# EasyEDA Pro project bipedwheel.eprj

# Schematic Schematic1
Board Name: Board1; Create Date: 2025-10-13; Page Name: P1; Project Name: bipedwheel; Schematic Name: Schematic1; Update Date: 2025-10-13; Company: 嘉立创EDA; Page Size: A4; Version: V1.0
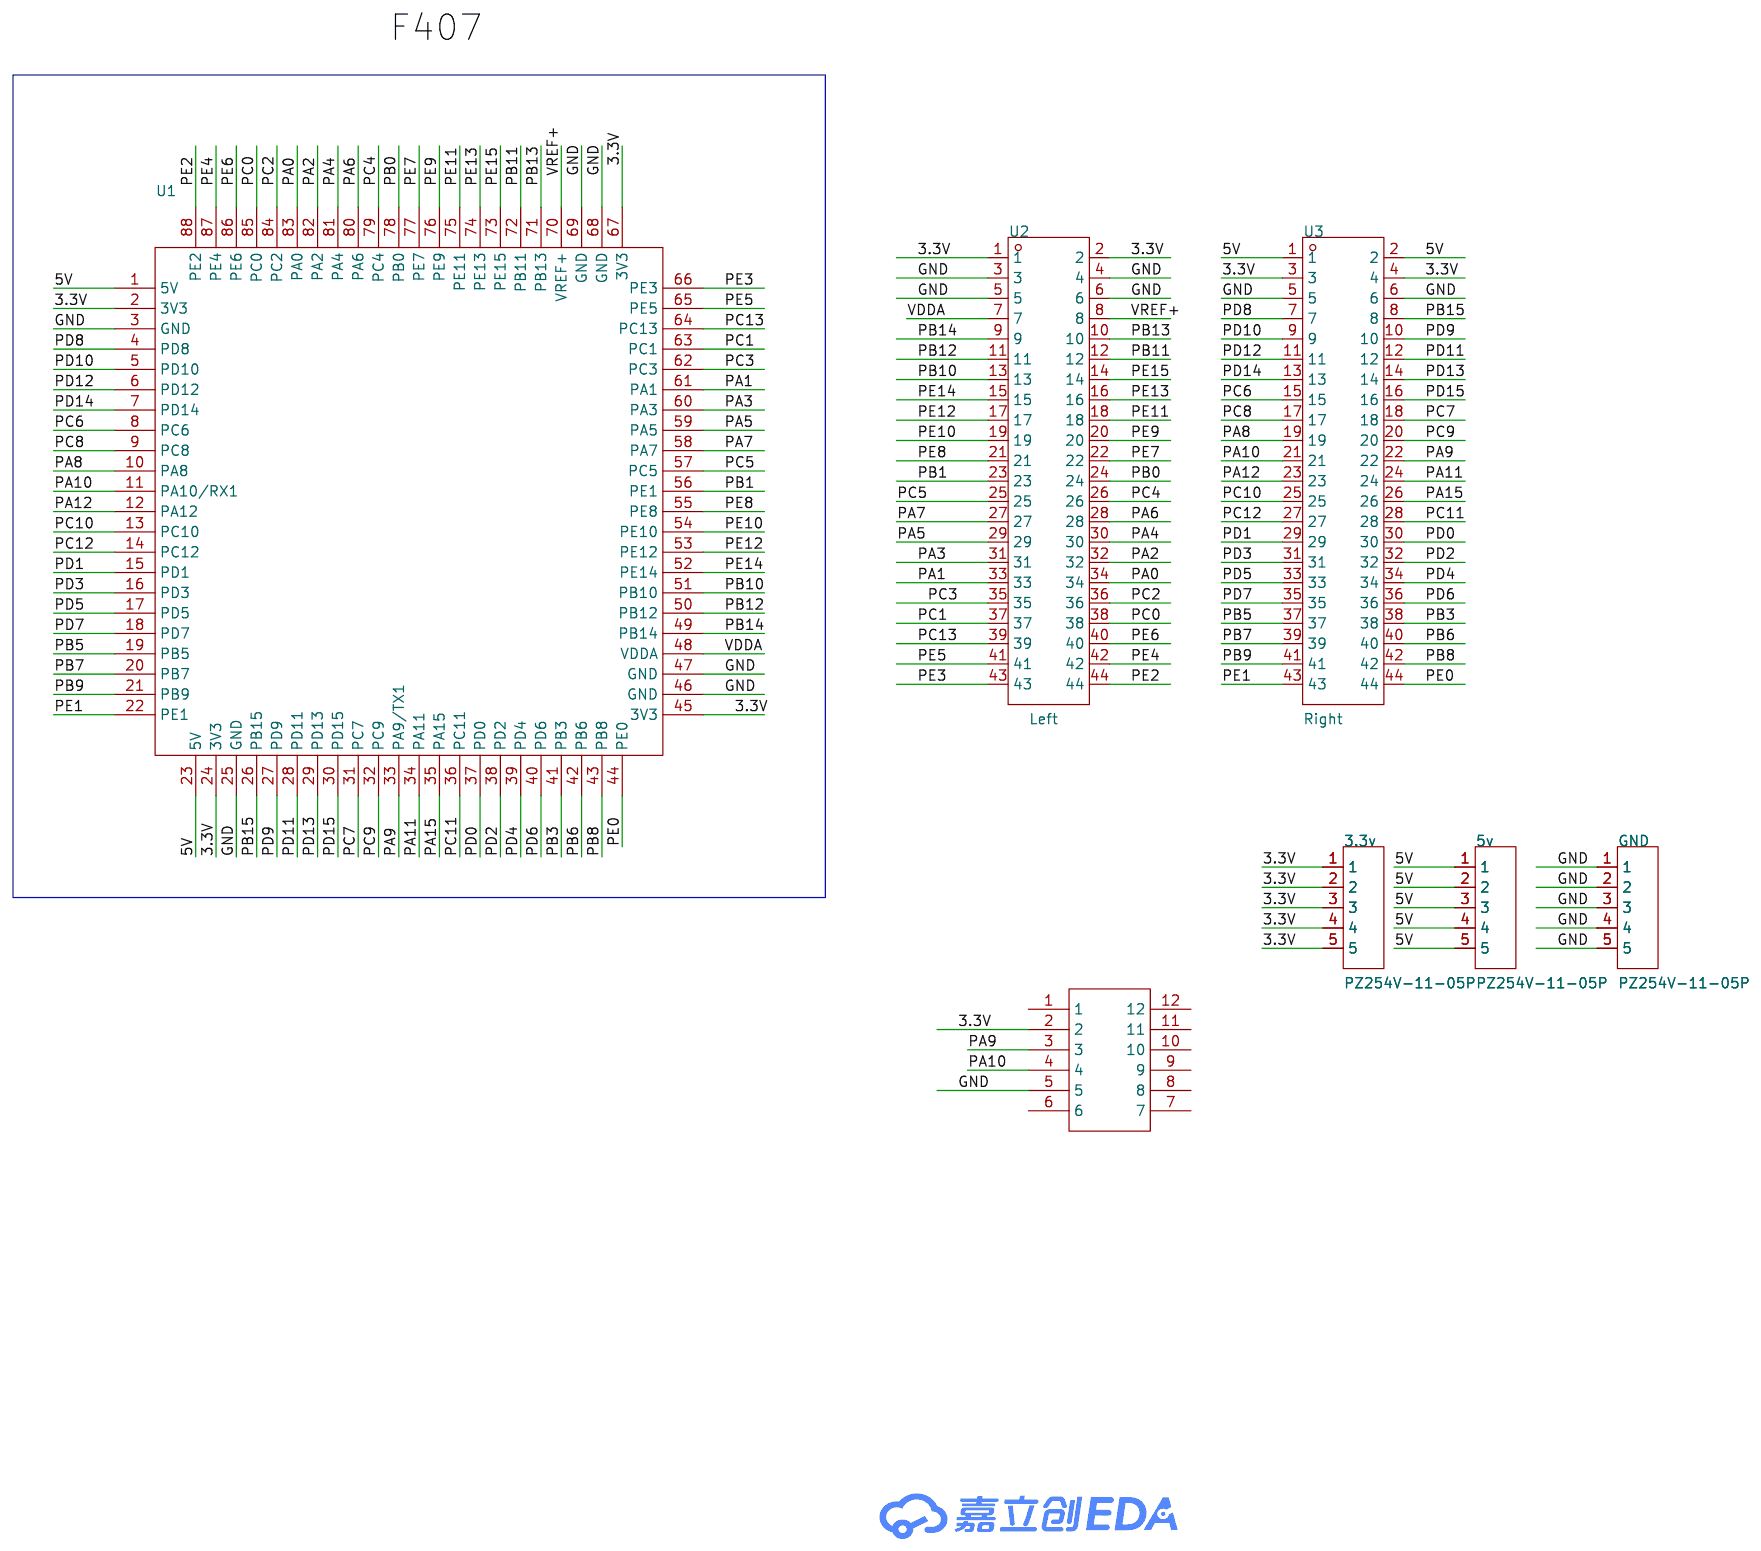
[diagram p0: schematic sheet]

## Parts
3.3v  PZ254V-11-05P  [HDR-TH_5P-P2.54-V-M]
5v  PZ254V-11-05P  [HDR-TH_5P-P2.54-V-M]
GND  PZ254V-11-05P  [HDR-TH_5P-P2.54-V-M]
JY901S  -  [JY901S_插件]
U1  -  [STM32F4XX最小系统板]
U2  Left  [HDR-TH_44P-P2.54-V-F-R2-C22-S2.54]
U3  Right  [HDR-TH_44P-P2.54-V-F-R2-C22-S2.54]

## Library data of the parts
3.3v 5v GND = PZ254V-11-05P: LCSC Part Name: 1x5P 间距:2.54mm 方针 直插; Supplier Part: C492404; Manufacturer: XFCN(兴飞); Supplier Footprint: 插件,P=2.54mm; JLCPCB Part Class: 扩展库; Datasheet: https://atta.szlcsc.com/upload/public/pdf/source/20200309/C492404_E51533260F8710EFF5D4617281164C1D.pdf; Supplier: LCSC; Pin Structure: 1x5P; Pitch: 2.54mm; Circluar Pins/Square Pins: 方针; Mounting Type: 直插; Number of Rows: 单排; Number of Pins: 5P; Length of Mating Pin: 6mm; Insulation Height: 2.5mm; Length of End Connection Pin: 3mm; Contact Material: 黄铜; Operating Temperature: -40℃~+105℃; Color: 黑色
JY901S = JY901S_插件
U1 = STM32F4xx 最小系统板
U2 U3 = X6521FV-2x22-C85D32: LCSC Part Name: 间距:2.54mm 2x22P 直插; Supplier Part: C2883995; Manufacturer: XKB Connection(中国星坤); Supplier Footprint: 插件,P=2.54mm; JLCPCB Part Class: 扩展库; Datasheet: https://item.szlcsc.com/datasheet/X6521FV-2x22-C85D32/3094487.html; Supplier: LCSC; Holes Structure: 2x22P; Pitch: 2.54mm; Row Spacing: 2.54mm; Circular Hole / Square Hole: 方孔; Mounting Type: 直插; Number of Rows: 双排; Number of Positions: 44P; Current Rating: 3A; Voltage Rating (Max): 250V; Holes Direction: 顶部; Insulation Height: 8.5mm; Contact Material: 黄铜; Contact Plating: 金; Operating Temperature: -40℃~+105℃

## Nets
3.3V: 3.3v.1 3.3v.2 3.3v.3 3.3v.4 3.3v.5 JY901S.2 U1.2(3V3) U1.24(3V3) U1.45(3V3) U1.67(3V3) U2.1 U2.2 U3.3 U3.4
5V: 5v.1 5v.2 5v.3 5v.4 5v.5 U1.1(5V) U1.23(5V) U3.1 U3.2
GND: GND.1 GND.2 GND.3 GND.4 GND.5 JY901S.5 U1.3(GND) U1.25(GND) U1.46(GND) U1.47(GND) U1.68(GND) U1.69(GND) U2.3 U2.4 U2.5 U2.6 U3.5 U3.6
VDDA: U1.48(VDDA) U2.7
PA0: U1.83(PA0) U2.34
PA1: U1.61(PA1) U2.33
PA2: U1.82(PA2) U2.32
PA3: U1.60(PA3) U2.31
PA4: U1.81(PA4) U2.30
PA5: U1.59(PA5) U2.29
PA6: U1.80(PA6) U2.28
PA7: U1.58(PA7) U2.27
PA8: U1.10(PA8) U3.19
PA9: JY901S.3 U1.33(PA9/TX1) U3.22
PA10: JY901S.4 U1.11(PA10/RX1) U3.21
PA11: U1.34(PA11) U3.24
PA12: U1.12(PA12) U3.23
PA15: U1.35(PA15) U3.26
PB0: U1.78(PB0) U2.24
PB1: U1.56(PE1) U2.23
PB3: U1.41(PB3) U3.38
PB5: U1.19(PB5) U3.37
PB6: U1.42(PB6) U3.40
PB7: U1.20(PB7) U3.39
PB8: U1.43(PB8) U3.42
PB9: U1.21(PB9) U3.41
PB10: U1.51(PB10) U2.13
PB11: U1.72(PB11) U2.12
PB12: U1.50(PB12) U2.11
PB13: U1.71(PB13) U2.10
PB14: U1.49(PB14) U2.9
PB15: U1.26(PB15) U3.8
PC0: U1.85(PC0) U2.38
PC1: U1.63(PC1) U2.37
PC2: U1.84(PC2) U2.36
PC3: U1.62(PC3) U2.35
PC4: U1.79(PC4) U2.26
PC5: U1.57(PC5) U2.25
PC6: U1.8(PC6) U3.15
PC7: U1.31(PC7) U3.18
PC8: U1.9(PC8) U3.17
PC9: U1.32(PC9) U3.20
PC10: U1.13(PC10) U3.25
PC11: U1.36(PC11) U3.28
PC12: U1.14(PC12) U3.27
PC13: U1.64(PC13) U2.39
PD0: U1.37(PD0) U3.30
PD1: U1.15(PD1) U3.29
PD2: U1.38(PD2) U3.32
PD3: U1.16(PD3) U3.31
PD4: U1.39(PD4) U3.34
PD5: U1.17(PD5) U3.33
PD6: U1.40(PD6) U3.36
PD7: U1.18(PD7) U3.35
PD8: U1.4(PD8) U3.7
PD9: U1.27(PD9) U3.10
PD10: U1.5(PD10) U3.9
PD11: U1.28(PD11) U3.12
PD12: U1.6(PD12) U3.11
PD13: U1.29(PD13) U3.14
PD14: U1.7(PD14) U3.13
PD15: U1.30(PD15) U3.16
PE0: U1.44(PE0) U3.44
PE1: U1.22(PE1) U3.43
PE2: U1.88(PE2) U2.44
PE3: U1.66(PE3) U2.43
PE4: U1.87(PE4) U2.42
PE5: U1.65(PE5) U2.41
PE6: U1.86(PE6) U2.40
PE7: U1.77(PE7) U2.22
PE8: U1.55(PE8) U2.21
PE9: U1.76(PE9) U2.20
PE10: U1.54(PE10) U2.19
PE11: U1.75(PE11) U2.18
PE12: U1.53(PE12) U2.17
PE13: U1.74(PE13) U2.16
PE14: U1.52(PE14) U2.15
PE15: U1.73(PE15) U2.14
VREF+: U1.70(VREF+) U2.8

Not connected (* = marked no-connect by the designer): JY901S 1 6 7 8 9 10 11 12

## Notes on the sheet
- F407

# Board PCB1
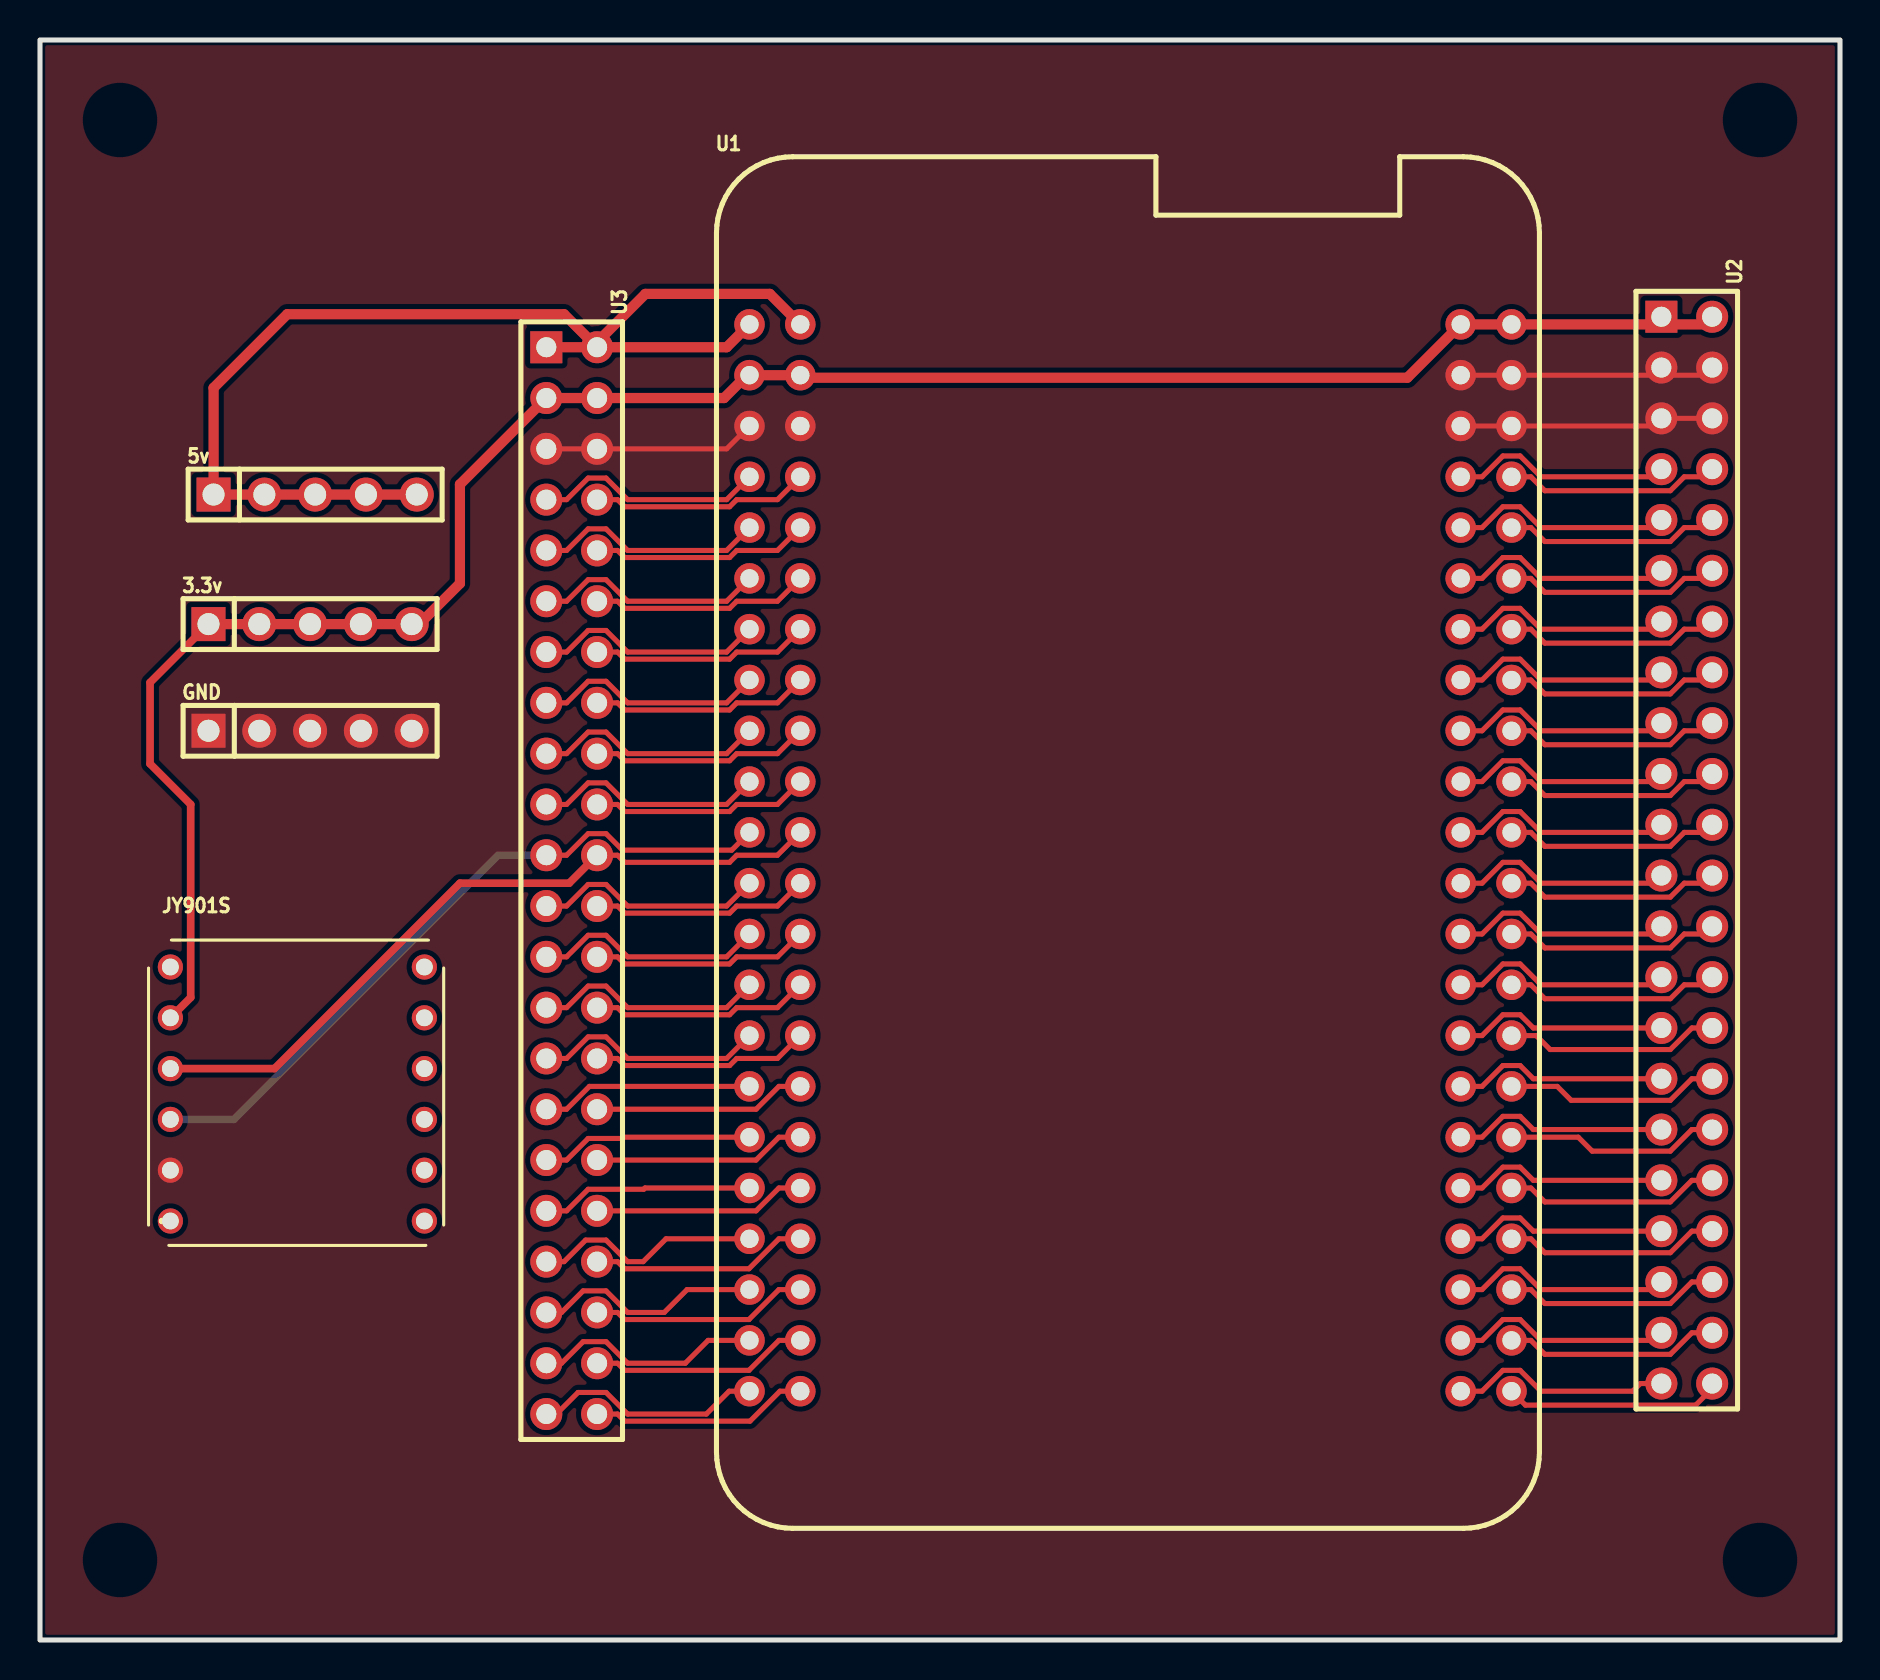
[diagram p1: board, top side]
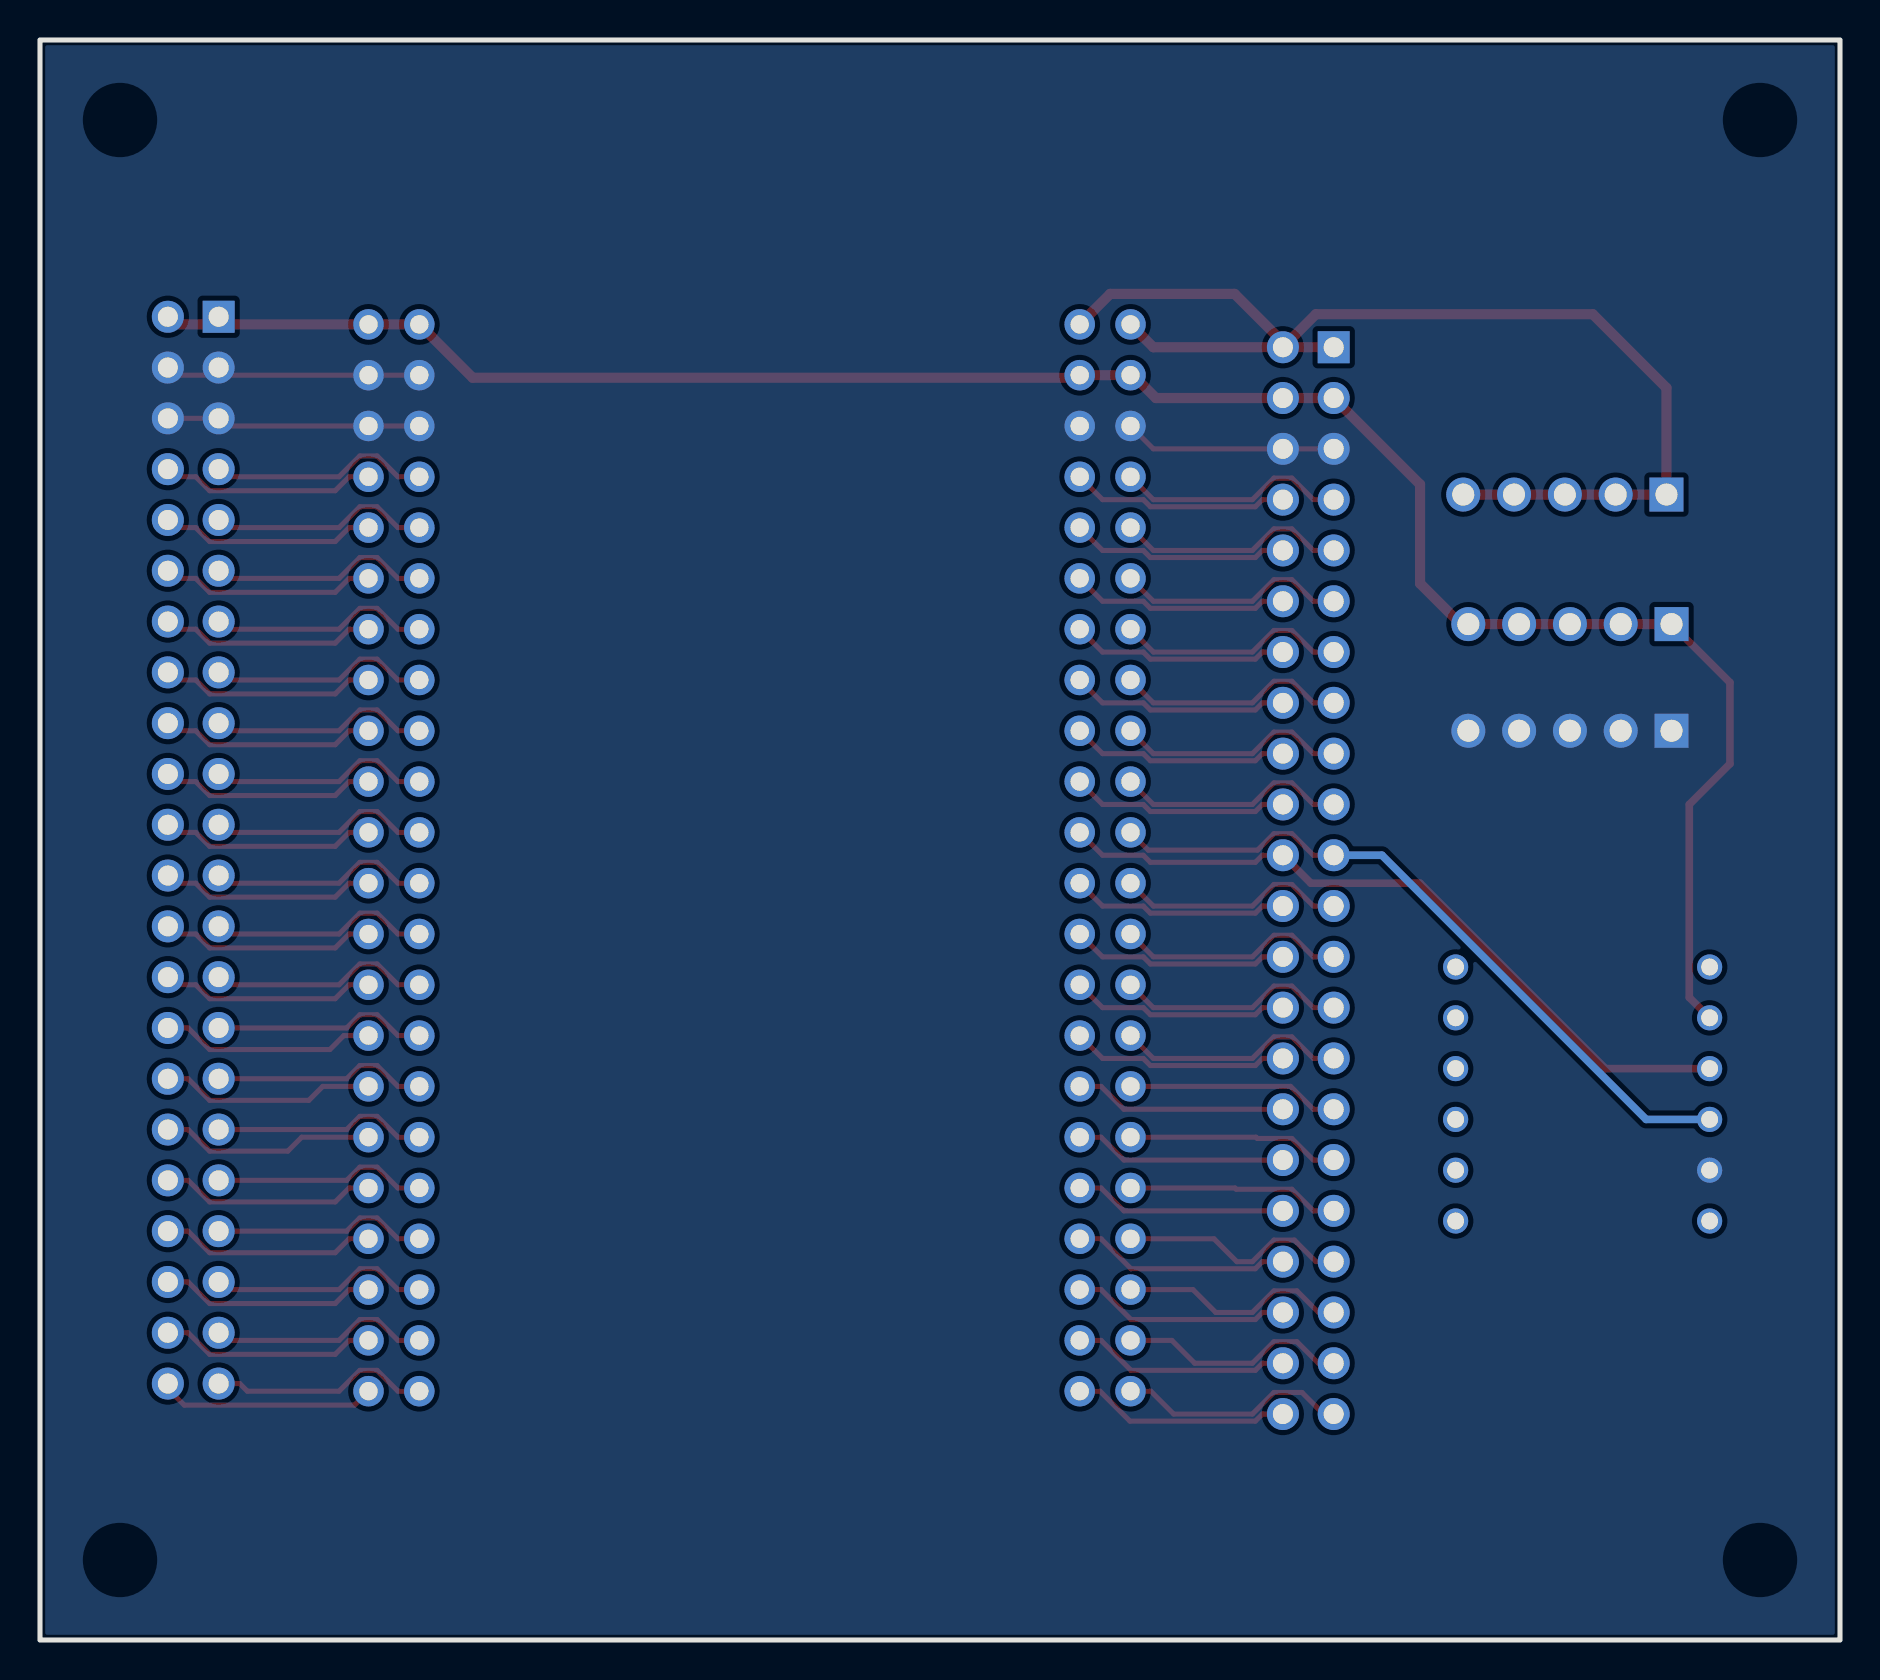
[diagram p2: board, bottom side, seen from below]

Outline 90 x 80 mm; copper layers: Top Layer, Bottom Layer. Coordinates in mm from the lower left corner of the outline.
Outline path: rectangle 0,80 90,0
Stack: Top Layer 0.035mm / Dielectric1 1.51mm FR4 er 4.5 / Bottom Layer 0.035mm

## Design rules (mm)
template: 自定义配置
spacing copperThickness1oz (default): track to track 0.102, other pairs 0.152 to 0.3
spacing copperThickness2oz: track to track 0.203, other pairs 0.152 to 0.3
track width copperThickness1oz (default): min 0.127, default 0.254, max 2.54
track width copperThickness2oz: min 0.203, default 0.254, max 2.54
differential pair differentialPair (default): width min 0.127, default 0.254, max 2.54; gap min 0.152, default 0.152
via viaSize (default): diameter min 0.5, default 0.61, max 10; hole min 0.3, default 0.305, max 6.3
net GND uses copperRegion2

## Placement (name value [footprint] x y rotation side)
3.3v  PZ254V-11-05P  [HDR-TH_5P-P2.54-V-M]  13.5 50.8 0 top
5v  PZ254V-11-05P  [HDR-TH_5P-P2.54-V-M]  13.76 57.27 0 top
GND  PZ254V-11-05P  [HDR-TH_5P-P2.54-V-M]  13.5 45.46 0 top
JY901S  -  [JY901S_插件]  12.87 27.17 0 top
U1  -  [STM32F4XX最小系统板]  35.47 65.78 0 top
U2  Left  [HDR-TH_44P-P2.54-V-F-R2-C22-S2.54]  82.34 39.49 270 top
U3  Right  [HDR-TH_44P-P2.54-V-F-R2-C22-S2.54]  26.59 37.97 270 top

## Footprints (pads in the part's own frame, mm; a bottom-side part is the same pattern mirrored in y, then rotated)
HDR-TH_5P-P2.54-V-M
  rect 1.7x1.7 hole 1.1: 1(-5.08,0)
  round 1.7 hole 1.1: 2(-2.54,0) 3(0,0) 4(2.54,0) 5(5.08,0)
HDR-TH_44P-P2.54-V-F-R2-C22-S2.54
  rect 1.6x1.6 hole 1: 1(-26.67,-1.27)
  round 1.6 hole 1: 2(-26.67,1.27) 3(-24.13,-1.27) 4(-24.13,1.27) 5(-21.59,-1.27) 6(-21.59,1.27) 7(-19.05,-1.27) 8(-19.05,1.27) 9(-16.51,-1.27) 10(-16.51,1.27) 11(-13.97,-1.27) 12(-13.97,1.27) 13(-11.43,-1.27) 14(-11.43,1.27) 15(-8.89,-1.27) 16(-8.89,1.27) 17(-6.35,-1.27) 18(-6.35,1.27) 19(-3.81,-1.27) 20(-3.81,1.27) 21(-1.27,-1.27) 22(-1.27,1.27) 23(1.27,-1.27) 24(1.27,1.27) 25(3.81,-1.27) 26(3.81,1.27) 27(6.35,-1.27) 28(6.35,1.27) 29(8.89,-1.27) 30(8.89,1.27) 31(11.43,-1.27) 32(11.43,1.27) 33(13.97,-1.27) 34(13.97,1.27) 35(16.51,-1.27) 36(16.51,1.27) 37(19.05,-1.27) 38(19.05,1.27) 39(21.59,-1.27) 40(21.59,1.27) 41(24.13,-1.27) 42(24.13,1.27) 43(26.67,-1.27) 44(26.67,1.27)
JY901S_插件
  round 1.26 hole 0.84: 1(-6.35,6.477) 2(-6.35,3.937) 3(-6.35,1.397) 4(-6.35,-1.143) 5(-6.35,-3.683) 6(-6.35,-6.223) 7(6.35,-6.223) 8(6.35,-3.683) 9(6.35,-1.143) 10(6.35,1.397) 11(6.35,3.937) 12(6.35,6.477)
STM32F4XX最小系统板
  round 1.524 hole 0.914: 1(0,0) 2(0,-2.54) 3(0,-5.08) 4(0,-7.62) 5(0,-10.16) 6(0,-12.7) 7(0,-15.24) 8(0,-17.78) 9(0,-20.32) 10(0,-22.86) 11(0,-25.4) 12(0,-27.94) 13(0,-30.48) 14(0,-33.02) 15(0,-35.56) 16(0,-38.1) 17(0,-40.64) 18(0,-43.18) 19(0,-45.72) 20(0,-48.26) 21(0,-50.8) 22(0,-53.34) 23(2.54,0) 24(2.54,-2.54) 25(2.54,-5.08) 26(2.54,-7.62) 27(2.54,-10.16) 28(2.54,-12.7) 29(2.54,-15.24) 30(2.54,-17.78) 31(2.54,-20.32) 32(2.54,-22.86) 33(2.54,-25.4) 34(2.54,-27.94) 35(2.54,-30.48) 36(2.54,-33.02) 37(2.54,-35.56) 38(2.54,-38.1) 39(2.54,-40.64) 40(2.54,-43.18) 41(2.54,-45.72) 42(2.54,-48.26) 43(2.54,-50.8) 44(2.54,-53.34) 45(35.56,0) 46(35.56,-2.54) 47(35.56,-5.08) 48(35.56,-7.62) 49(35.56,-10.16) 50(35.56,-12.7) 51(35.56,-15.24) 52(35.56,-17.78) 53(35.56,-20.32) 54(35.56,-22.86) 55(35.56,-25.4) 56(35.56,-27.94) 57(35.56,-30.48) 58(35.56,-33.02) 59(35.56,-35.56) 60(35.56,-38.1) 61(35.56,-40.64) 62(35.56,-43.18) 63(35.56,-45.72) 64(35.56,-48.26) 65(35.56,-50.8) 66(35.56,-53.34) 67(38.1,0) 68(38.1,-2.54) 69(38.1,-5.08) 70(38.1,-7.62) 71(38.1,-10.16) 72(38.1,-12.7) 73(38.1,-15.24) 74(38.1,-17.78) 75(38.1,-20.32) 76(38.1,-22.86) 77(38.1,-25.4) 78(38.1,-27.94) 79(38.1,-30.48) 80(38.1,-33.02) 81(38.1,-35.56) 82(38.1,-38.1) 83(38.1,-40.64) 84(38.1,-43.18) 85(38.1,-45.72) 86(38.1,-48.26) 87(38.1,-50.8) 88(38.1,-53.34)

## Nets
As in the schematic.

Pads without a net: JY901S 1 6 7 8 9 10 11 12

## Routing (per net, layer and track width the routed paths; a pad name or vN(x,y) marks a point on that pad's centre or on a via; arc(x,y) is an arc through that point)
3.3V: length 106.9
  Top Layer w0.381: 3.3v.1 5.5,47.87 5.5,43.81 7.53,41.78 7.53,32.13 JY901S.2
  Top Layer w0.508: 3.3v.1 3.3v.2 3.3v.3 3.3v.4 3.3v.5 18.97,50.8 21,52.83 21,57.78 U3.3 U3.4 34.21,62.1 35.47,63.37 U1.2 U1.24 38.14,63.11 68.37,63.11 U1.45 U1.67 83.23,65.78 U2.2
5V: length 59.6
  Top Layer w0.508: U3.2 26.2,66.29 12.36,66.29 8.68,62.61 5v.1 5v.2 5v.3 5v.4 5v.5 ; U3.2 U3.1 ; U3.2 27.85,64.89 30.27,67.31 36.49,67.31 U1.23 ; U3.2 34.33,64.64 U1.1
GND: length 36.1
  Top Layer w0.254: 35.47,60.7 34.33,59.56 U3.6 U3.5 ; U2.6 U2.5 80.69,60.7 71.03,60.7 ; U2.4 83.23,63.24 U1.68 U1.46
VDDA: length 11.1
  Top Layer w0.254: U1.48 72.1,58.16 73.14,59.2 74.01,59.2 75.05,58.16 80.69,58.16 U2.7
PA0: length 10.8
  Top Layer w0.254: U2.34 82.59,25.52 81.51,24.44 77.61,24.44 76.91,25.14 U1.83
PA1: length 10.7
  Top Layer w0.254: U1.61 72.1,25.14 73.14,26.18 74.01,26.18 74.67,25.52 U2.33
PA2: length 10.8
  Top Layer w0.254: U2.32 82.59,28.06 81.51,26.98 76.56,26.98 75.86,27.68 73.57,27.68
PA3: length 10.7
  Top Layer w0.254: U2.31 74.67,28.06 74.01,28.72 73.14,28.72 72.1,27.68 71.03,27.68
PA4: length 10.8
  Top Layer w0.254: U2.30 82.59,30.6 81.51,29.52 75.51,29.52 74.81,30.22 U1.81
PA5: length 10.7
  Top Layer w0.254: U2.29 74.67,30.6 74.01,31.26 73.14,31.26 72.1,30.22 U1.59
PA6: length 10.8
  Top Layer w0.254: U2.28 83.23,32.76 82.21,32.76 81.51,32.06 75.24,32.06 74.54,32.76 U1.80
PA7: length 11.1
  Top Layer w0.254: U1.58 72.1,32.76 73.14,33.8 74.01,33.8 75.05,32.76 80.69,32.76 U2.27
PA8: length 11.5
  Top Layer w0.254: U1.10 34.33,41.78 29.38,41.78 28.3,42.86 27.41,42.86 26.33,41.78 U3.19
PA9: length 36.7
  Top Layer w0.254: U3.22 28.88,39.24 29.23,38.88 34.48,38.88 34.84,39.24 36.87,39.24 U1.33
  Top Layer w0.381: JY901S.3 11.73,28.57 21,37.84 26.46,37.84 U3.22
PA10: length 35.6
  Top Layer w0.254: U3.21 26.33,39.24 27.41,40.32 28.3,40.32 29.13,39.49 34.59,39.49 U1.11
  Bottom Layer w0.381: U3.21 22.9,39.24 9.69,26.03 JY901S.4
PA11: length 10.9
  Top Layer w0.254: 38.01,37.84 36.87,36.7 34.84,36.7 34.48,36.34 29.23,36.34 28.88,36.7 U3.24
PA12: length 11.5
  Top Layer w0.254: U3.23 26.33,36.7 27.41,37.78 28.3,37.78 29.38,36.7 34.33,36.7 35.47,37.84
PA15: length 10.9
  Top Layer w0.254: U3.26 28.88,34.16 29.23,33.8 34.48,33.8 34.84,34.16 36.87,34.16 U1.35
PB0: length 10.8
  Top Layer w0.254: 73.57,37.84 74.54,37.84 75.24,37.14 81.51,37.14 82.21,37.84 83.23,37.84 U2.24
PB1: length 11.1
  Top Layer w0.254: U2.23 80.69,37.84 75.05,37.84 74.01,38.88 73.14,38.88 72.1,37.84 71.03,37.84
PB3: length 10.9
  Top Layer w0.254: U1.41 36.95,20.06 35.45,18.56 29.23,18.56 28.88,18.92 U3.38
PB5: length 11.5
  Top Layer w0.254: U3.37 26.2,18.92 27.28,20 28.3,20 29.38,18.92 30.16,18.92 31.3,20.06 U1.19
PB6: length 10.9
  Top Layer w0.254: 38.01,17.52 36.95,17.52 35.45,16.02 29.23,16.02 28.88,16.38 U3.40
PB7: length 11.5
  Top Layer w0.254: 35.47,17.52 32.35,17.52 31.21,16.38 29.38,16.38 28.3,17.46 27.16,17.46 26.08,16.38 U3.39
PB8: length 10.9
  Top Layer w0.254: U1.43 36.95,14.98 35.45,13.48 29.23,13.48 28.88,13.84 U3.42
PB9: length 11.5
  Top Layer w0.254: U3.41 26.08,13.84 27.16,14.92 28.3,14.92 29.38,13.84 32.26,13.84 33.41,14.98 U1.21
PB10: length 11.1
  Top Layer w0.254: 71.03,50.54 72.1,50.54 73.14,51.58 74.01,51.58 75.05,50.54 80.69,50.54 U2.13
PB11: length 10.8
  Top Layer w0.254: U1.72 74.54,53.08 75.24,52.38 81.51,52.38 82.21,53.08 83.23,53.08 U2.12
PB12: length 11.1
  Top Layer w0.254: U2.11 80.69,53.08 75.05,53.08 74.01,54.12 73.14,54.12 72.1,53.08 U1.50
PB13: length 10.8
  Top Layer w0.254: U2.10 83.23,55.62 82.21,55.62 81.51,54.92 75.24,54.92 74.54,55.62 73.57,55.62
PB14: length 11.1
  Top Layer w0.254: U2.9 80.69,55.62 75.05,55.62 74.01,56.66 73.14,56.66 72.1,55.62 71.03,55.62
PB15: length 10.9
  Top Layer w0.254: U1.26 36.87,57.02 34.84,57.02 34.48,56.66 29.23,56.66 28.88,57.02 U3.8
PC0: length 10.8
  Top Layer w0.254: U1.85 74.54,20.06 75.24,19.36 81.51,19.36 82.59,20.44 U2.38
PC1: length 10.7
  Top Layer w0.254: U1.63 72.1,20.06 73.14,21.1 74.01,21.1 74.67,20.44 U2.37
PC2: length 10.8
  Top Layer w0.254: U2.36 82.59,22.98 81.51,21.9 75.24,21.9 74.54,22.6 U1.84
PC3: length 10.7
  Top Layer w0.254: U2.35 74.67,22.98 74.01,23.64 73.14,23.64 72.1,22.6 U1.62
PC4: length 10.8
  Top Layer w0.254: U2.26 83.23,35.3 82.21,35.3 81.51,34.6 75.24,34.6 74.54,35.3 U1.79
PC5: length 11.1
  Top Layer w0.254: U1.57 72.1,35.3 73.14,36.34 74.01,36.34 75.05,35.3 80.69,35.3 U2.25
PC6: length 11.5
  Top Layer w0.254: U3.15 26.33,46.86 27.41,47.94 28.3,47.94 29.38,46.86 34.33,46.86 U1.8
PC7: length 10.9
  Top Layer w0.254: U3.18 28.88,44.32 29.23,43.96 34.48,43.96 34.84,44.32 36.87,44.32 38.01,45.46
PC8: length 11.5
  Top Layer w0.254: 35.47,45.46 34.33,44.32 29.38,44.32 28.3,45.4 27.41,45.4 26.33,44.32 U3.17
PC9: length 10.9
  Top Layer w0.254: U3.20 28.88,41.78 29.23,41.42 34.48,41.42 34.84,41.78 36.87,41.78 U1.32
PC10: length 11.5
  Top Layer w0.254: U1.13 34.33,34.16 29.38,34.16 28.3,35.24 27.41,35.24 26.33,34.16 U3.25
PC11: length 10.9
  Top Layer w0.254: U3.28 28.88,31.62 29.23,31.26 34.48,31.26 34.84,31.62 36.87,31.62 U1.36
PC12: length 11.5
  Top Layer w0.254: U1.14 34.33,31.62 29.38,31.62 28.3,32.7 27.41,32.7 26.33,31.62 U3.27
PC13: length 11.1
  Top Layer w0.254: 71.03,17.52 72.1,17.52 73.14,18.56 74.01,18.56 75.05,17.52 80.69,17.52 U2.39
PD0: length 10.9
  Top Layer w0.254: U1.37 36.87,29.08 34.84,29.08 34.48,28.72 29.23,28.72 28.88,29.08 U3.30
PD1: length 11.5
  Top Layer w0.254: U1.15 34.33,29.08 29.38,29.08 28.3,30.16 27.41,30.16 26.33,29.08 U3.29
PD2: length 10.6
  Top Layer w0.254: 38.01,27.68 36.95,27.68 35.8,26.54 U3.32
PD3: length 10.6
  Top Layer w0.254: 35.47,27.68 27.47,27.68 26.33,26.54 U3.31
PD4: length 10.6
  Top Layer w0.254: U1.39 36.95,25.14 35.8,24 U3.34
PD5: length 10.6
  Top Layer w0.254: U1.17 29.2,25.14 29.13,25.08 27.41,25.08 26.33,24 U3.33
PD6: length 10.6
  Top Layer w0.254: U1.40 36.95,22.6 35.8,21.46 U3.36
PD7: length 10.6
  Top Layer w0.254: U1.18 30.25,22.6 30.19,22.54 27.41,22.54 26.33,21.46 U3.35
PD8: length 11.5
  Top Layer w0.254: U3.7 26.33,57.02 27.41,58.1 28.3,58.1 29.38,57.02 34.33,57.02 U1.4
PD9: length 10.9
  Top Layer w0.254: U3.10 28.88,54.48 29.23,54.12 34.48,54.12 34.84,54.48 36.87,54.48 38.01,55.62
PD10: length 11.5
  Top Layer w0.254: 35.47,55.62 34.33,54.48 29.38,54.48 28.3,55.56 27.41,55.56 26.33,54.48 U3.9
PD11: length 10.9
  Top Layer w0.254: U1.28 36.87,51.94 34.84,51.94 34.48,51.58 29.23,51.58 28.88,51.94 U3.12
PD12: length 11.5
  Top Layer w0.254: U1.6 34.33,51.94 29.38,51.94 28.3,53.02 27.41,53.02 26.33,51.94 U3.11
PD13: length 10.9
  Top Layer w0.254: U3.14 28.88,49.4 29.23,49.04 34.48,49.04 34.84,49.4 36.87,49.4 38.01,50.54
PD14: length 11.5
  Top Layer w0.254: U3.13 26.33,49.4 27.41,50.48 28.3,50.48 29.38,49.4 34.33,49.4 35.47,50.54
PD15: length 10.9
  Top Layer w0.254: U1.30 36.87,46.86 34.84,46.86 34.48,46.5 29.23,46.5 28.88,46.86 U3.16
PE0: length 10.9
  Top Layer w0.254: U3.44 28.88,11.3 29.23,10.94 35.5,10.94 37,12.44 U1.44
PE1: length 11.5
  Top Layer w0.254: U1.22 34.46,12.44 33.32,11.3 29.38,11.3 28.3,12.38 26.9,12.38 25.82,11.3 U3.43
PE2: length 10.9
  Top Layer w0.254: U1.88 74.27,11.74 82.78,11.74 83.61,12.57 U2.44
PE3: length 11.1
  Top Layer w0.254: U1.66 72.1,12.44 73.14,13.48 74.01,13.48 75.05,12.44 79.63,12.44 80.01,12.82 U2.43
PE4: length 10.8
  Top Layer w0.254: U1.87 74.54,14.98 75.24,14.28 81.51,14.28 82.59,15.36 U2.42
PE5: length 11.1
  Top Layer w0.254: U1.65 72.1,14.98 73.14,16.02 74.01,16.02 75.05,14.98 80.69,14.98 U2.41
PE6: length 10.8
  Top Layer w0.254: U2.40 82.59,17.9 81.51,16.82 75.24,16.82 74.54,17.52 73.57,17.52
PE7: length 10.8
  Top Layer w0.254: U2.22 83.23,40.38 82.21,40.38 81.51,39.68 75.24,39.68 74.54,40.38 U1.77
PE8: length 11.1
  Top Layer w0.254: U1.55 72.1,40.38 73.14,41.42 74.01,41.42 75.05,40.38 80.69,40.38 U2.21
PE9: length 10.8
  Top Layer w0.254: U2.20 83.23,42.92 82.21,42.92 81.51,42.22 75.24,42.22 74.54,42.92 U1.76
PE10: length 11.1
  Top Layer w0.254: U2.19 80.69,42.92 75.05,42.92 74.01,43.96 73.14,43.96 72.1,42.92 U1.54
PE11: length 10.8
  Top Layer w0.254: U2.18 83.23,45.46 82.21,45.46 81.51,44.76 75.24,44.76 74.54,45.46 73.57,45.46
PE12: length 11.1
  Top Layer w0.254: 71.03,45.46 72.1,45.46 73.14,46.5 74.01,46.5 75.05,45.46 80.69,45.46 U2.17
PE13: length 10.8
  Top Layer w0.254: U2.16 83.23,48 82.21,48 81.51,47.3 75.24,47.3 74.54,48 U1.74
PE14: length 11.1
  Top Layer w0.254: U1.52 72.1,48 73.14,49.04 74.01,49.04 75.05,48 80.69,48 U2.15
PE15: length 10.8
  Top Layer w0.254: 73.57,50.54 74.54,50.54 75.24,49.84 81.51,49.84 82.21,50.54 83.23,50.54 U2.14
VREF+: length 10.8
  Top Layer w0.254: U2.8 83.23,58.16 82.21,58.16 81.51,57.46 75.24,57.46 74.54,58.16 U1.70

## Copper pours and planes (outline as drawn; the poured copper is in the pictures)
GND on Top Layer: -5.67,84.45 94.66,84.45 94.66,-4.96 -5.67,-4.96
GND on Bottom Layer: -5.93,87.62 91.99,87.62 91.99,-4.83 -5.93,-4.83
